# EAGLE design Radar for Home Assistant V1.1 (EAGLE 6.1)
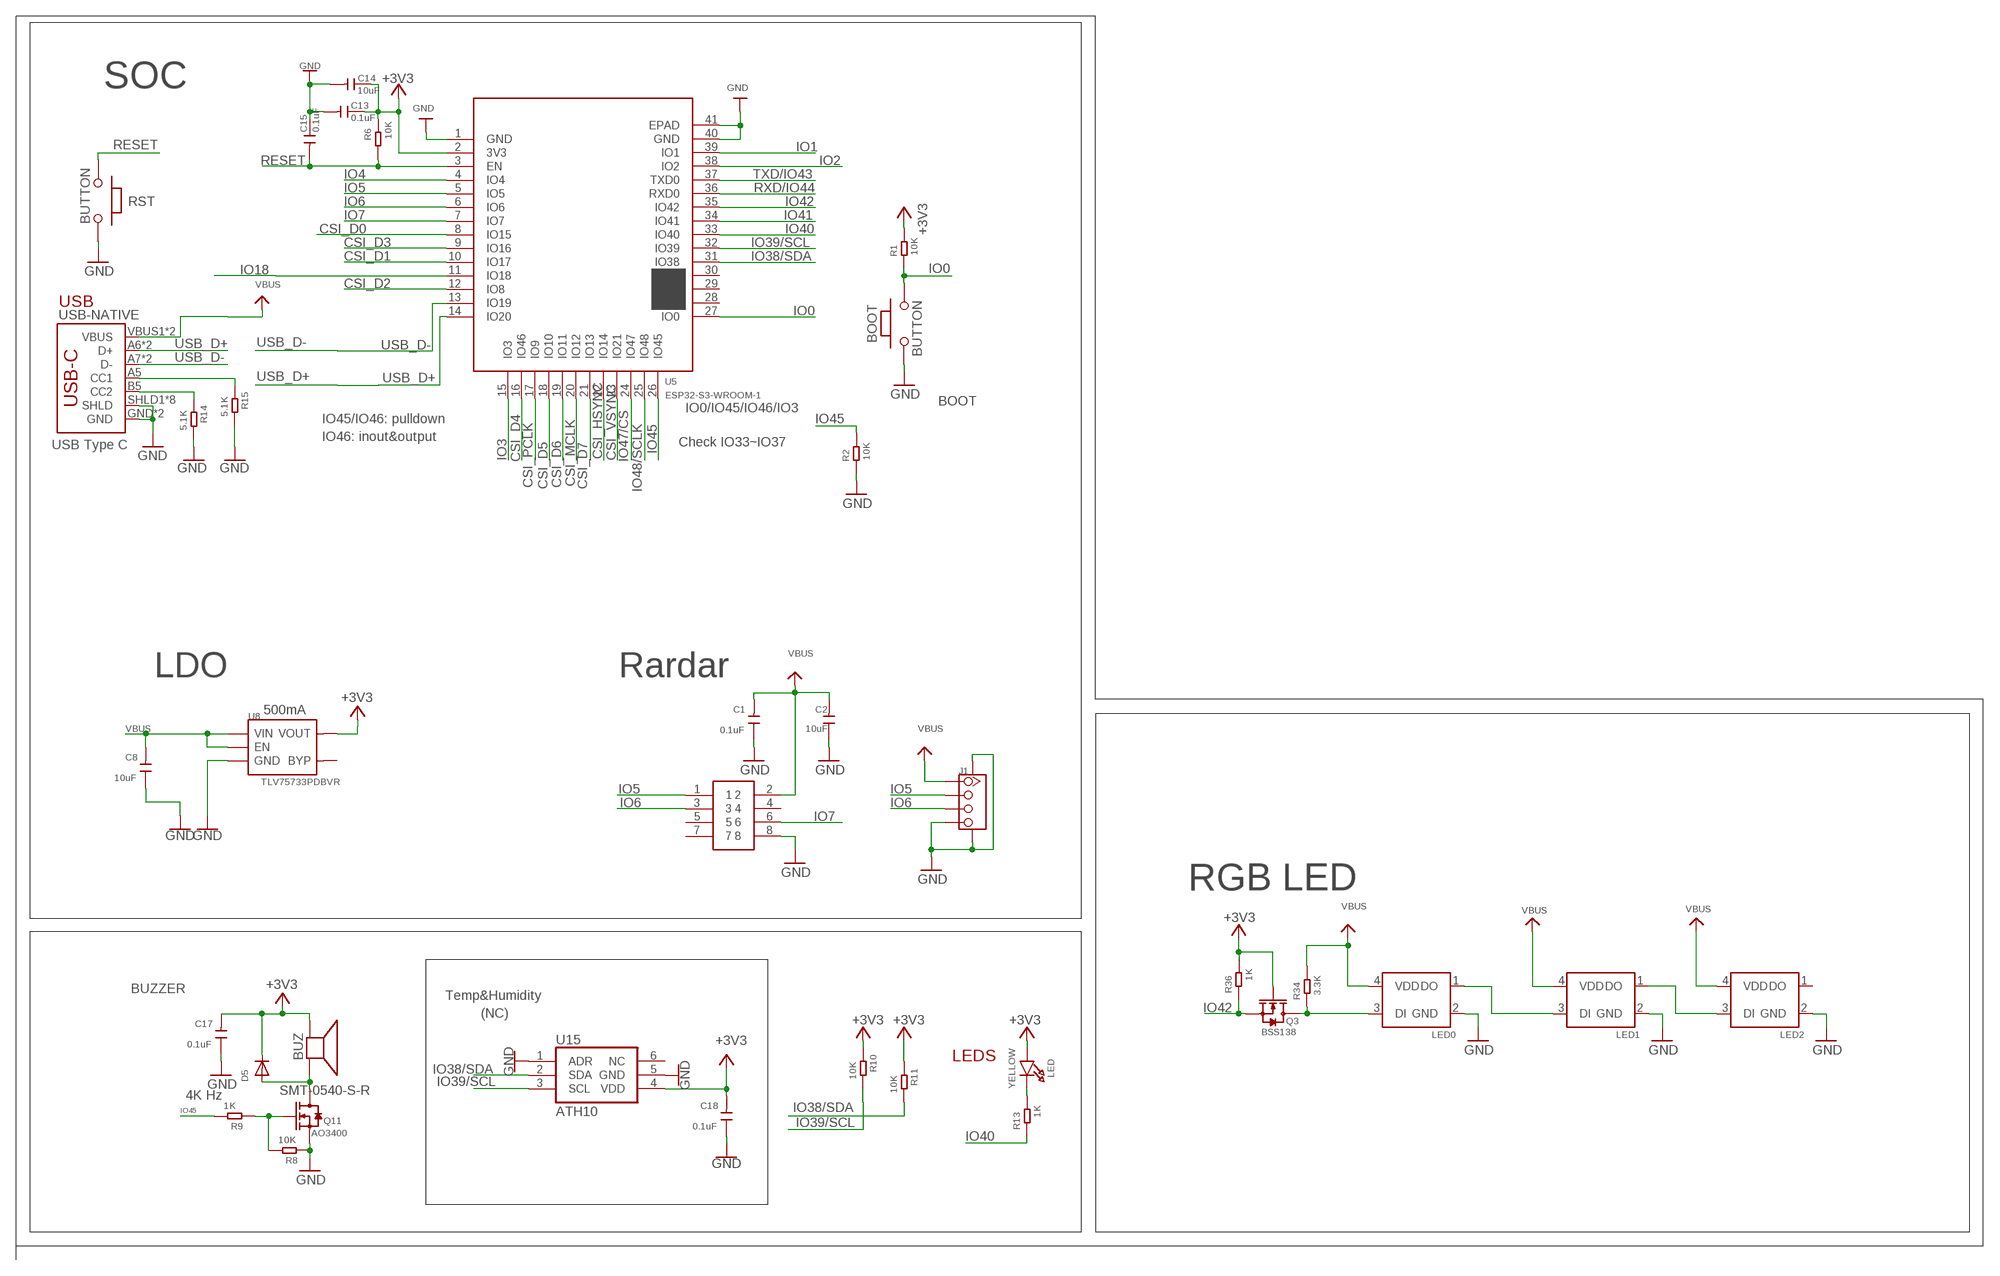
[diagram p0: schematic, sheet 1]

## Parts
BOOT  BUTTON  PB157  [157SW]
BUZ  SMT-0540-S-R  [SMT-0540-S-R]
C1  0.1uF  DISCRETE_C-0402  [DISCRETE_C0402]
C2  10uF  DISCRETE_C-0402  [DISCRETE_C0402]
C8  10uF  DISCRETE_C-0402  [DISCRETE_C0402]
C13  0.1uF  DISCRETE_C-0402  [DISCRETE_C0402]
C14  10uF  DISCRETE_C-0402  [DISCRETE_C0402]
C15  0.1uF  DISCRETE_C-0402  [DISCRETE_C0402]
C17  0.1uF  DISCRETE_C-0402  [DISCRETE_C0402]
C18  0.1uF  DISCRETE_C-0402  [DISCRETE_C0402]
D5  DIODESOD-323F  [SOD-323F]
J1  TWIG-4P-2.0-SMD-FEMALE-REINFORCE  [4P-SMD-2.0-90D-W/O-BUCKLE]
J3  CON2X4-2.0MM-THD  [CON2X4-2.0MM-THD]
LED  YELLOW  LED0805_NOOUTLINE  [CHIPLED_0805_NOOUTLINE]
LED0  WS2812B-2020  [WS2812B-2020]
LED1  WS2812B-2020  [WS2812B-2020]
LED2  WS2812B-2020  [WS2812B-2020]
Q3  BSS138  MOSFET-N'SOT23'  [SOT23@1]
Q11  AO3400  MOSFET-N'SOT23'  [SOT23@1]
R1  10K  DISCRETE_R-0402  [DISCRETE_R0402]
R2  10K  DISCRETE_R-0402  [DISCRETE_R0402]
R6  10K  DISCRETE_R-0402  [DISCRETE_R0402]
R8  10K  DISCRETE_R-0402  [DISCRETE_R0402]
R9  1K  DISCRETE_R-0402  [DISCRETE_R0402]
R10  10K  DISCRETE_R-0402  [DISCRETE_R0402]
R11  10K  DISCRETE_R-0402  [DISCRETE_R0402]
R13  1K  DISCRETE_R-0402  [DISCRETE_R0402]
R14  5.1K  DISCRETE_R-0402  [DISCRETE_R0402]
R15  5.1K  DISCRETE_R-0402  [DISCRETE_R0402]
R34  3.3K  DISCRETE_R-0402  [DISCRETE_R0402]
R36  1K  DISCRETE_R-0402  [DISCRETE_R0402]
RST  BUTTON  PB157  [157SW]
U5  ESP32-S3-WROOM-1  [ESP32-S3-WROOM-1]
U8  TLV75733PDBVR  SPX3819  [SOT23-5]
U15  ATH10  [AHT10]
USB-NATIVE  USB_C5  [USB-C-16P-5]

## Nets
+3V3: BUZ.+(-) C13.1 C14.1 C17.2 C18.2 D5.C LED.A Q3.1(G) R1.2 R6.2 R10.1 R11.1 R36.2 U5.2(3V3) U8.5(VOUT) U15.4(VDD)
CSI_D0: U5.8(IO15)
CSI_D1: U5.10(IO17)
CSI_D2: U5.12(IO8)
CSI_D3: U5.9(IO16)
CSI_D4: U5.16(IO46)
CSI_D5: U5.18(IO10)
CSI_D6: U5.19(IO11)
CSI_D7: U5.21(IO13)
CSI_HSYNC: U5.22(IO14)
CSI_MCLK: U5.20(IO12)
CSI_PCLK: U5.17(IO9)
CSI_VSYNC: U5.23(IO21)
GND: BOOT.1 C1.1 C2.1 C8.1 C13.2 C14.2 C15.1 C17.1 C18.1 J1.4 J1.SS1 J1.SS2 J3.8 LED0.2(GND) LED1.2(GND) LED2.2(GND) Q11.2(S) R2.1 R8.1 R14.2 R15.2 RST.1 U5.1(GND) U5.40(GND) U5.41(EPAD) U8.2(GND) U15.1(ADR) U15.5(GND) USB-NATIVE.GND USB-NATIVE.GND2(GND) USB-NATIVE.SHLD1(SHLD) USB-NATIVE.SHLD2(SHLD) USB-NATIVE.SHLD3(SHLD) USB-NATIVE.SHLD4(SHLD) USB-NATIVE.SHLD5(SHLD) USB-NATIVE.SHLD6(SHLD) USB-NATIVE.SHLD7(SHLD) USB-NATIVE.SHLD8(SHLD)
IO0: BOOT.2 R1.1 U5.27(IO0)
IO1: U5.39(IO1)
IO2: U5.38(IO2)
IO3: U5.15(IO3)
IO4: U5.4(IO4)
IO5: J1.2 J3.1 U5.5(IO5)
IO6: J1.3 J3.3 U5.6(IO6)
IO7: J3.6 U5.7(IO7)
IO18: U5.11(IO18)
IO38/SDA: R11.2 U5.31(IO38) U15.2(SDA)
IO39/SCL: R10.2 U5.32(IO39) U15.3(SCL)
IO40: R13.1 U5.33(IO40)
IO41: U5.34(IO41)
IO42: Q3.2(S) R36.1 U5.35(IO42)
IO45: R2.2 R9.2 U5.26(IO45)
IO47/CS: U5.24(IO47)
IO48/SCLK: U5.25(IO48)
M-1: BUZ.-(+) D5.A Q11.3(D)
N$5: LED1.1(DO) LED2.3(DI)
N$6: LED0.1(DO) LED1.3(DI)
N$18: LED.C R13.2
N$20: LED0.3(DI) Q3.3(D) R34.1
N$25: Q11.1(G) R8.2 R9.1
N$33: R15.1 USB-NATIVE.A5(CC1)
N$34: R14.1 USB-NATIVE.B5(CC2)
RESET: C15.2 R6.1 RST.2 U5.3(EN)
RXD/IO44: U5.36(RXD0)
TXD/IO43: U5.37(TXD0)
USB_D+: U5.14(IO20) USB-NATIVE.A6(D+) USB-NATIVE.B6(D+)
USB_D-: U5.13(IO19) USB-NATIVE.A7(D-) USB-NATIVE.B7(D-)
VBUS: C1.2 C2.2 C8.2 J1.1 J3.2 LED0.4(VDD) LED1.4(VDD) LED2.4(VDD) R34.2 U8.1(VIN) U8.3(EN) USB-NATIVE.VBUS1(VBUS) USB-NATIVE.VBUS2(VBUS)
Unconnected: J3.4 J3.5 J3.7 LED2.1(DO) U5.28(IO35) U5.29(IO36) U5.30(IO37) U8.4(BYP) U15.6(NC)

## Notes on the sheet
- SOC
- USB
- BOOT
- IO0/IO45/IO46/IO3
- IO45/IO46: pulldown
- IO46: inout&output
- USB Type C | Check IO33~IO37
- LDO | Rardar
- 500mA
- RGB LED
- BUZZER
- Temp&Humidity
- (NC)
- LEDS
- 4K Hz

## Library data of the parts
BOOT RST = MySMD:PB157
BUZ = adafruit:SMT-0540-S-R: SMT-0549-S-R Small surface-mount magnetic buzzer
C1 C2 C8 C13-C15 C17 C18 = A9G:DISCRETE_C*: Ceramic Capacitors
D5 = adafruit2:DIODE: Diode SMADIODE - SMA Surface Mount Package 20V 1A Schottky Diode Digikey: 641-1014-6-ND DO-1N4148 - Through Hole Small Current Diode SOD-123 20V 1 A (.5mV Vf) Schottky Diode - Digikey: MBRX120TPMSCT-ND SOD-323 10V 570mA (.38mV Vf, 3ns) Schottky Diode - Digikey: ZLLS410CT-ND SOD-523 30V 30mA Schottky Diode (RB751S-40TE61) - Digikey: RB751S-40TE61CT-ND SOT23-R/W - SOT23 Package (R = Solder Paste/Reflow Ovens, W = Hand-Soldering) BAT54Film 40V 300mA - Digikey: 497-7162-1-ND
J1 = Connector:TWIG-4P-2.0-SMD-FEMALE-REINFORCE
J3 = user:CON2X4-2.0MM-THD
LED = microbuilder:LED: LED 0603 - 0603 Surface Mount Package 2mA: Green LED - Low Power (3.9mcd, 2ma, 1.7Vf) - Digikey: 475-2709-2-ND Orange LED - Low Power (9.8mcd, 2ma, 1.8Vf) - Digikey: 475-1194-2-ND Red LED - Low Power (5mcd, 2ma, 1.8Vf) - Digikey: 475-1195-2-ND Yellow LED - Low Power (7mcd, 2ma, 1.8Vf) - Digikey: 475-1196-2-ND 5mA: Blue LED - Low Power (17mcd, 5ma, 2.9Vf) - Digikey: LNJ937W8CRACT-ND 0805 - 0805 Surface Mount Package 2mA: Red LED (8.8mcd, 2mA, 1.8Vf, Clear) - Low Power [Digikey: 475-2510-1-ND] Green LED (5mcd, 2mA, 1.8Vf, Clear) - Low Power [Digikey: 475-2730-1-ND] Yellow LED (11.3mcd, 2mA, 1.8Vf, Clear) - Low Power [Digikey: 475-2555-1-ND] 20mA: Red LED (104mcd, 20mA, Diffused) - LS R976 [Digikey: 475-1278-6-ND] Red LED (12mcd, 20mA, 2.0Vf, Clear) - APT2012EC [Digikey: 754-1128-1-ND] Green LED (15mcd, 20mA, 2.2Vf, Clear) - APT2012GC [Digikey: 754-1131-1-ND] Orange LED (160mcd, 20mA, 2.1Vf, Clear) - APT2012SECK [Digikey: 754-1130-1-ND] 1206 - 1206 Surface Mount Package Green LED (26mcd, 20mA, Diffused) - LG N971 [Digikey: 475-1407-6-ND] Red LED (15mcd, 20mA, Diffused) - LH N974 [Digikey: 475-1416-6-ND] Cree - Cree High-Power Surface Mount LEDs XPEBWT-L1-0000-00D50 - White 111lm 350mA 2.9Vf 6200K 110° XTEAWT-00-0000-00000LEE3 - White 114lm 350mA 2.85Vf 5000K 115° Everlight - Everlight 45-21 Series Surface Mount LEDs 45-21/QK2C-B2832AC2CB2/2T - Warm White 2000mcd 20mA 3.25Vf 3050K 120° 45-21/LK2C-B38452C4CB2/2T - Nuetral White 2000mcd 20mA 3.25Vf 4150K 120° 45-21/LK2C-B50634C6CB2/2T - Cold White 2200mcd 20mA 3.25Vf 5650K 120° PLCC2 Reverse Mount LS T77K-J1L2-1-0-2-R18-Z - Red 11.25mcd 2mA 1.8Vf 630nm 120° LO T77K-L1M2-24-Z - Orange 19.6mcd 2mA 1.8Vf 606nm 120° LY T77K-K2M1-26-Z - Yellow 15.7mcd 2mA 1.8Vf 587nm 120°
LED0 LED1 LED2 = user:WS2812B-2020
Q3 Q11 = Discrete:MOSFET-N: IRLL014: http://www.vishay.com/docs/91319/sihll014.pdf
R1 R2 R6 R8-R11 R13-R15 R34 R36 = A9G:DISCRETE_R*
U5 = self:ESP32-S3-WROOM-1
U8 = IC:SPX3819
U15 = Makerfabs-Peter:ATH10
USB-NATIVE = USBC:USB_C: USB Type C 16Pin Connector Super Speed pins not available on the 16-pin purely SMD connector so this part is best for USB 2.0 implementations. D1 and D2 are tied together enabling D+/- no matter which way the cable is plugged into the connector. The two channel configuration pins (CC1/2) are exposed. These are normally connected to ground via 5.1k resistors but can be reconfigured for high current/high power applications.

## Net classes
0 default: width 0.203 mm, drill 0.305 mm, clearance 0.152 mm
2 gnd: width 0.305 mm, drill 0.559 mm, clearance 0.254 mm
3 usbvcc: width 0.508 mm, drill 0.61 mm, clearance 0.254 mm
4 USBpair: width 0.254 mm, drill 0.406 mm, clearance 0.406 mm

## Board
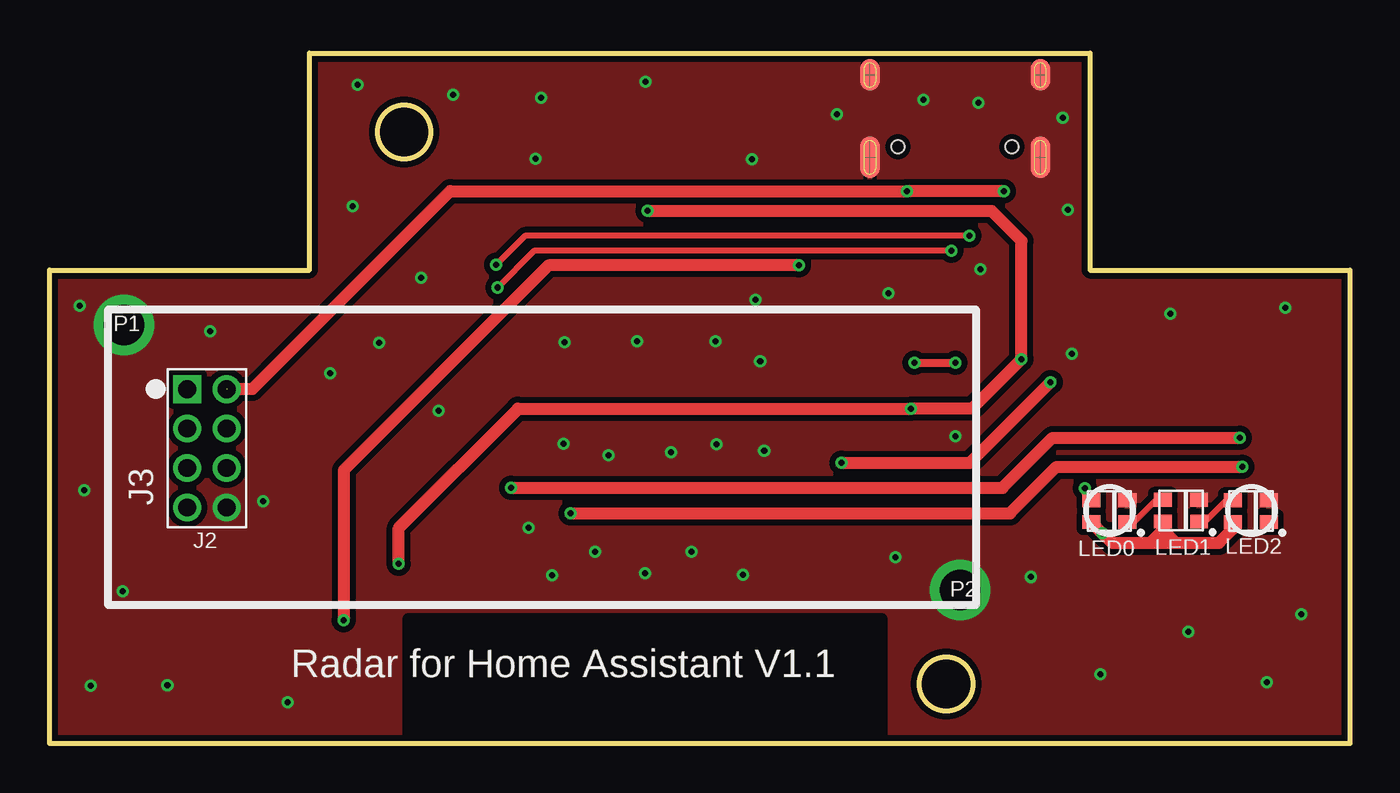
[diagram p1: board, top side]
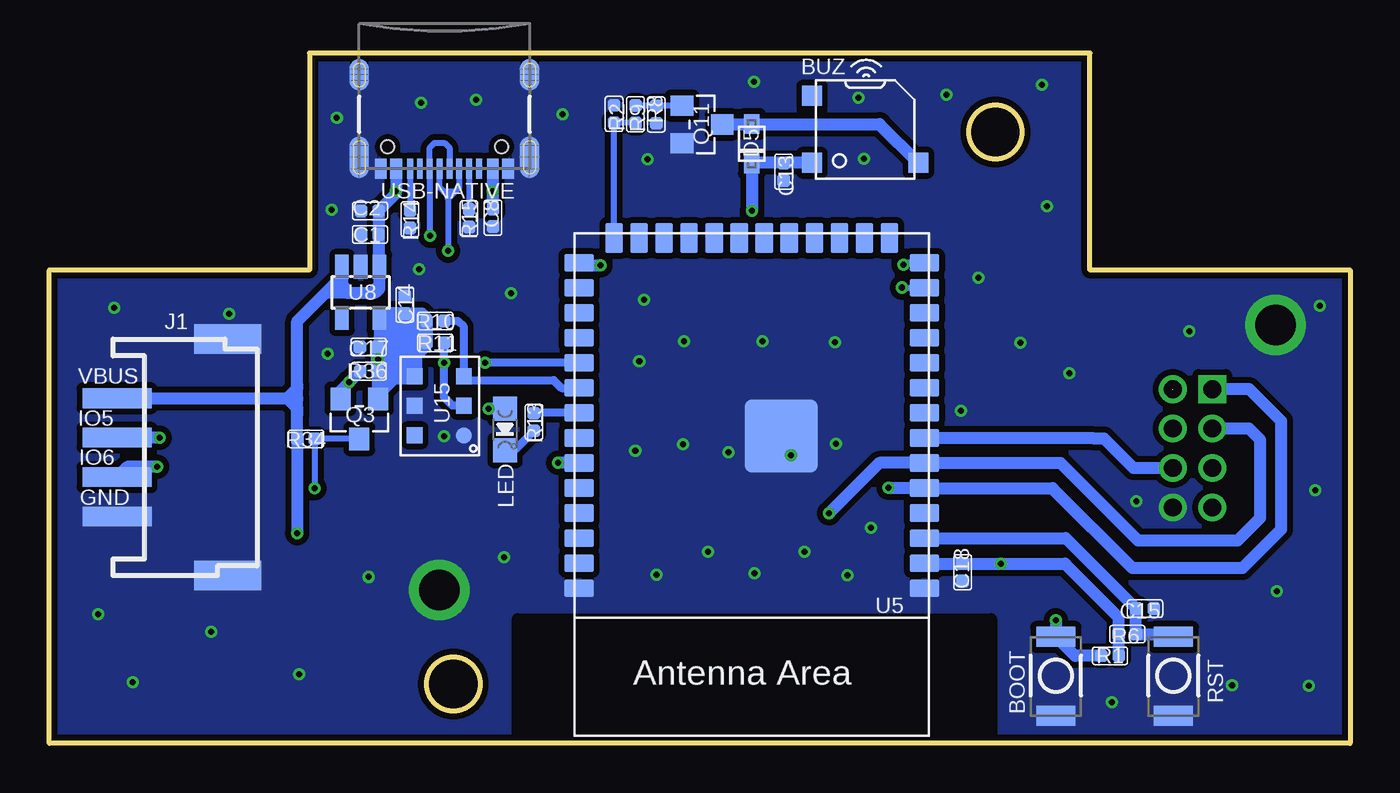
[diagram p2: board, bottom side, seen from below]

Size 66 x 35 mm. Coordinates in mm from the lower left corner, seen from the top.
Outline: 0,24 0,0 66,0 66,24 52.8,24 52.8,35 13.2,35 13.2,24 0,24
Outline: circle at 18,31 radius 1.35
Outline: circle at 45.5,3 radius 1.35
Copper layers (1*16): Top 0.035mm / dielectric 1.5mm / Bottom 0.035mm
Design rules: minimum track width 6mil, minimum drill 8mil, track to track 6mil, track to pad 6mil, pad to pad 6mil, via to via 6mil, smd to smd 0mil, copper to edge 10mil, drill to drill 10mil, minimum pad ring 10mil, minimum via ring 6mil, stop-mask expansion 2mil, vias tented up to drill 30mil, thermal gap 0mil
tRestrict: area 18.2,0.1 to 42.2,6.3
bRestrict: area 18.2,0.1 to 42.2,6.3

### Footprints (pad centres in the part's own frame; a part is rotated, then mirrored left to right if it is on the bottom)
157SW = smd 1.016 x 1.981: 1 0,0; 2 4,0
SMT-0540-S-R = smd 1 x 1: + 1.7,-2.7; - 1.7,2.7; M -1.7,-2.7
DISCRETE_C0402 = smd 0.635 x 0.635: 1 -0.445,0; 2 0.445,0
SOD-323F = smd 1 x 0.8: A -1,0; C 1,0
4P-SMD-2.0-90D-W/O-BUCKLE = smd 1 x 3.5: 1 -3,0; 2 -1,0; 3 1,0; 4 3,0 | smd 1.5 x 3.4: SS1 -6,5.6; SS2 6,5.6
CON2X4-2.0MM-THD = drill 0.9 pad 1.4 square: 1 -3,-1 | drill 0.9 pad 1.4: 2 -3,1; 3 -1,-1; 4 -1,1; 5 1,-1; 6 1,1; 7 3,-1; 8 3,1
CHIPLED_0805_NOOUTLINE = smd 1.2 x 1.2: A 0,-1.05; C 0,1.05
WS2812B-2020 = smd 0.9 x 0.7: 1 -0.915,0.55; 2 -0.915,-0.55; 3 0.915,-0.55; 4 0.915,0.55
SOT23@1 = smd 1.016 x 1.143: 1 -0.95,-1.016; 2 0.95,-1.016; 3 0,1.016
DISCRETE_R0402 = smd 0.635 x 0.635: 1 -0.445,0; 2 0.445,0
ESP32-S3-WROOM-1 = smd 1.5 x 0.9: 1 -8.75,5.26; 2 -8.75,3.99; 3 -8.75,2.72; 4 -8.75,1.45; 5 -8.75,0.18; 6 -8.75,-1.09; 7 -8.75,-2.36; 8 -8.75,-3.63; 9 -8.75,-4.9; 10 -8.75,-6.17; 11 -8.75,-7.44; 12 -8.75,-8.71; 13 -8.75,-9.98; 14 -8.75,-11.25; 27 8.75,-11.25; 28 8.75,-9.98; 29 8.75,-8.71; 30 8.75,-7.44; 31 8.75,-6.17; 32 8.75,-4.9; 33 8.75,-3.63; 34 8.75,-2.36; 35 8.75,-1.09; 36 8.75,0.18; 37 8.75,1.45; 38 8.75,2.72; 39 8.75,3.99; 40 8.75,5.26 | smd 0.9 x 1.5: 15 -6.985,-12.5; 16 -5.715,-12.5; 17 -4.445,-12.5; 18 -3.175,-12.5; 19 -1.905,-12.5; 20 -0.635,-12.5; 21 0.635,-12.5; 22 1.905,-12.5; 23 3.175,-12.5; 24 4.445,-12.5; 25 5.715,-12.5; 26 6.985,-12.5 | smd 3.7 x 3.7: 41 -1.5,-2.46
SOT23-5 = smd 0.69 x 1.2: 1 -0.95,-1.3; 2 0,-1.3; 3 0.95,-1.3; 4 0.95,1.3; 5 -0.95,1.3
AHT10 = smd 0.8 x 0.8: 1 0.777,3.985; 2 0.777,2.485; 3 0.777,0.985; 4 3.277,0.985; 5 3.277,2.485; 6 3.277,3.985
USB-C-16P-5 = smd 0.3 x 1: A5 -1.25,-0.34; A6 -0.25,-0.34; A7 0.25,-0.34; A8 1.25,-0.34; B5 1.75,-0.34; B6 0.75,-0.34; B7 -0.75,-0.34; B8 -1.75,-0.34 | smd 0.6 x 1: GND -3.225,-0.34; GND2 3.225,-0.34; VBUS1 -2.45,-0.34; VBUS2 2.45,-0.34 | smd 1 x 2.1: SHLD1 -4.32,-0.915; SHLD2 4.32,-0.915 | smd 1 x 2.1 bottom: SHLD3 -4.32,-0.915; SHLD4 4.32,-0.915 | smd 1 x 1.6: SHLD5 -4.32,-5.095; SHLD8 4.32,-5.095 | smd 1 x 1.6 bottom: SHLD6 -4.32,-5.095; SHLD7 4.32,-5.095 | hole 0.65: -2.89,-1.445; 2.89,-1.445

### Placement (x,y rotation side)
BOOT  14.93,1.4 90 bottom
BUZ  24.61,31.14 270 bottom
C1  49.73,25.81 0 bottom
C2  49.73,27 0 bottom
C8  43.49,26.65 90 bottom
C13  28.74,28.99 270 bottom
C14  47.96,22.24 90 bottom
C15  10.41,6.83 180 bottom
C17  49.8,20.1 0 bottom
C18  19.66,8.67 90 bottom
D5  30.36,30.4 270 bottom
J1  62.56,14.5 270 bottom
J3  8,14.96 270 top
LED  42.88,15.91 180 bottom
LED0  53.78,11.77 180 top
LED1  57.41,11.8 180 top
LED2  60.96,11.77 180 top
Q3  50.28,16.45 180 bottom
Q11  32.88,31.38 270 bottom
R1  12.18,4.44 0 bottom
R2  37.35,31.92 270 bottom
R6  11.31,5.53 180 bottom
R8  35.21,31.89 90 bottom
R9  36.26,31.9 270 bottom
R10  46.42,21.42 0 bottom
R11  46.42,20.31 0 bottom
R13  41.41,16.29 270 bottom
R14  47.7,26.57 270 bottom
R15  44.7,26.62 270 bottom
R34  52.97,15.44 180 bottom
R36  49.79,18.87 0 bottom
RST  8.97,1.4 90 bottom
U5  30.36,13.12 180 bottom
U8  50.2,22.87 180 bottom
U15  44.19,19.6 180 bottom
USB-NATIVE  45.95,28.8 180 bottom

### Tracks (layer width: path | path; a pad name or v marks a point on that pad's centre or on a via)
+3V3  (via drill 0.3)
  Top 0.61: v30.35,27 47.8,27 49.33,25.48 v49.33,19.48 46.81,16.97 v43.71,16.97 23.77,16.97 17.73,10.92 v17.73,9.09
  Bottom 0.254: U5.2 17.77,9.13 v17.73,9.09 | v49.33,19.48 49.33,19.41 49.36,19.38 | 47.37,19.68 47.41,19.68 47.47,19.63
  Bottom 0.305: R36.2 | v43.71,16.96 v43.71,16.97
  Bottom 0.61: BUZ.+ C13.1 30.33,29.43 D5.C v30.36,27.01 v30.35,27 | U5.2 21.59,9.11 C18.2 14.47,9.11 11.76,6.4 R6.2 11.75,4.45 R1.2 | LED.A v43.71,16.96 | R36.2 49.33,18.85 Q3.1 49.25,17.54 U8.5 49.02,21.8 C14.1 47.24,21.8 R10.1 R11.1 47.47,19.7 47.47,19.63 U15.4 | R36.2 49.36,19.38 C17.2 | 47.07,21.23 49.12,21.23 49.12,17.88 | 49.12,17.35 49.12,17.88 | 49.12,17.88 48.49,18.52 47.37,18.52 47.37,19.68 46.86,20.19 46.86,21.57 47.09,21.79 48.11,21.79 48.72,21.18 48.72,18.54 48.26,19 48.26,20.78 47.27,20.78 47.27,20.73 47.8,20.19 47.8,18.82
GND  (via drill 0.3, 2.05 pad 2.54)
  other vias: 3.78,21.22 46.22,7.78 16.74,20.32 15.65,33.4 15.39,27.23 1.55,22.2 2.11,2.92 12.09,2.08 10.85,12.27 63.53,6.55 61.77,3.1 53.31,3.51 49.81,8.43 56.87,21.79 62.71,22.1 47.14,32.49 44.35,32.64 51.41,31.72 51.66,27.05 39.95,31.9 35.66,29.62 30.25,33.55 20.5,32.89 24.94,32.74 24.66,29.64 26.14,20.35 29.82,20.4 33.81,20.4 42.57,22.83 19.76,16.87 25.5,8.51 30.23,8.61 35.2,8.53 27.69,9.7 32.59,9.7 24.31,10.92 42.93,9.42 45.97,15.57 26.09,15.19 28.37,14.61 31.55,14.76 36.27,14.83 33.86,15.16 35.84,22.5 36.07,19.38 47.24,24.03 51.87,19.76 18.87,23.6 8.15,20.9 14.25,18.77 1.78,12.83 3.73,7.72 5.99,2.95 57.78,5.66
  pour Bottom (isolate 0.305, rank 6): -3.81,-3.81 71,-3.81 71,41 -3.81,41
  pour Top (isolate 0.305, rank 6): -2.54,-2.54 70,-2.54 70,40 -2.54,40
IO0  (via drill 0.3)
  Top 0.61: v38.02,24.23 25.32,24.23 14.94,13.84 v14.94,6.25
  Bottom 0.305: BOOT.2
  Bottom 0.61: R1.1 13.97,4.44 BOOT.2 | v14.94,6.25 BOOT.2 | U5.27 38.97,24.23 v38.02,24.23
IO5  (via drill 0.3)
  Top 0.61: v23.42,12.95 48.36,12.95 50.9,15.49 v60.4,15.49
  Bottom 0.61: v23.42,12.95 23.41,12.95 U5.5 15.1,12.95 11.05,8.89 5.46,8.89 3.5,10.85 3.5,16.33 5.13,17.96 7.06,17.96 J3.1 | v60.4,15.49 J1.2
IO6  (via drill 0.3)
  Top 0.61: v26.44,11.66 48.74,11.66 51.1,14.02 v60.53,14.02
  Bottom 0.61: v26.44,11.66 23.89,14.21 U5.6 14.7,14.21 10.77,10.29 5.71,10.29 4.57,11.43 4.57,15.39 5.13,15.95 7.04,15.95 J3.3 | v60.53,14.02 62.04,14.02 J1.3
IO7
  Bottom 0.61: U5.7 21.6,15.47 13,15.47 12.5,15.47 11,13.97 J3.6
IO38/SDA  (via drill 0.3)
  Top 0.406: v43.89,19.3 v45.97,19.3
  Bottom 0.305: v43.88,19.3 v43.89,19.3
  Bottom 0.406: U5.31 v43.88,19.3 | U15.2 45.54,17.12 45.97,17.55 v45.97,19.3 R11.2
IO39/SCL
  Bottom 0.406: U5.32 39.13,18.01 40.01,18.01 40.41,18.41 44.76,18.41 U15.3 44.97,21.11 45.26,21.41 R10.2
IO40
  Bottom 0.305: 41.4,16.75 R13.1
  Bottom 0.406: U5.33 41.4,16.75
IO42  (via drill 0.3)
  Top 0.61: v40.18,14.22 46.71,14.22 v50.8,18.31
  Bottom 0.254: 51.23,17.88 51.23,17.89 v50.8,18.31
  Bottom 0.61: R36.1 51.23,17.88 Q3.2 | U5.35 v40.17,14.21 v40.18,14.22
IO45
  Bottom 0.305: U5.26 R2.2 36.28,31.47 R9.2
M-1
  Bottom 0.61: Q11.3 31.84,31.41 D5.A 23.88,31.41 BUZ.-
N$5
  Top 0.305: LED1.1 58.64,11.25 59.72,12.32 LED2.3
N$6
  Top 0.305: LED0.1 55.04,11.22 56.16,12.35 LED1.3
N$18
  Bottom 0.406: LED.C 42.4,14.86 R13.2
N$20  (via drill 0.3)
  Top 0.305: v52.53,12.93 52.53,12.66 LED0.3
  Bottom 0.305: Q3.3 R34.1 v52.53,12.93
N$25
  Bottom 0.305: Q11.1 R8.2 35.22,32.34 R9.1
N$33
  Bottom 0.305: USB-NATIVE.A5 R15.1
N$34
  Bottom 0.305: USB-NATIVE.B5 R14.1 | R14.1
RESET
  Bottom 0.61: RST.2 9.1,5.53 R6.1 10.86,6.82 C15.2 14.43,10.4 U5.3
USB_D+  (via drill 0.3)
  Top 0.305: v46.69,25.73 24.13,25.73 v22.66,24.26
  Bottom 0.254: v22.66,24.26 22.68,24.26 22.68,24.36 22.69,24.36 22.69,24.38
  Bottom 0.305: USB-NATIVE.A6 45.7,30.21 45.95,30.45 46.46,30.45 46.7,30.21 USB-NATIVE.B6 46.7,25.75 v46.69,25.73 | U5.14 22.69,24.38
USB_D-  (via drill 0.3)
  Top 0.305: v45.77,24.97 24.59,24.97 v22.73,23.11
  Bottom 0.305: v22.73,23.11 21.62,23.11 U5.13 | USB-NATIVE.B7 45.2,28.18 45.34,28.04 45.41,27.96 | 45.77,27.61 45.77,27.81 45.82,27.81 45.97,27.96 | 45.77,27.61 v45.77,24.97 | 45.41,27.96 45.97,27.96 | 45.97,27.96 46.2,28.19 USB-NATIVE.A7 | 45.41,27.96 45.77,27.61
VBUS  (via drill 0.3)  (1 unrouted)
  Top 0.61: 55.85,10.16 53.93,10.16 v53.43,10.66 LED0.4 | 55.85,10.16 56.54,10.16 | 56.54,10.16 57.15,10.16 | 57.15,10.16 59.33,10.16 60.05,10.87 LED2.4 | LED1.4 56.5,10.2 56.54,10.16 | v48.42,28 v43.51,28 20.34,28 10.3,17.96 9.02,17.96 | 55.85,10.16 56.49,10.79 56.49,10.82 57.15,10.16
  Bottom 0.254: v43.51,28 43.51,27.12 C8.2
  Bottom 0.61: U8.3 51.15,23.67 | 51.15,23.67 51.15,23.06 50.95,22.86 | 50.95,22.86 50.8,22.86 | 49.61,22.86 49.45,22.86 49.25,23.06 49.25,23.22 | 49.25,23.22 U8.1 49.29,24.2 C1.2 C2.2 48.42,27.87 v48.42,28 48.4,28.02 USB-NATIVE.VBUS2 | 53.42,17.42 R34.2 53.42,10.67 v53.43,10.66 | 53.42,17.42 53.42,17.5 | 53.42,17.5 53.42,21.41 51.15,23.67 | J1.1 53.49,17.5 53.42,17.42 | 50.95,22.86 51.97,22.86 | 51.97,22.86 52.63,22.2 | 51.97,22.86 51.21,23.62 51.21,23.27 50.8,22.86 | 50.8,22.86 49.61,22.86 | 49.61,22.86 49.25,23.22 | 53.42,18.16 53.42,18.01 53.92,17.5 | 53.92,17.5 53.42,16.99 53.42,16.66 | USB-NATIVE.VBUS1 C8.2 | 53.92,17.5 53.42,17.5

### Text on the board
tPlace: P1 | J2 | P2 | Radar for Home Assistant V1.1
bPlace: BUZ | VBUS | IO5 | IO6 | GND